# Altium schematic sheet PWR_Supply.SchDoc: Phaser
size 420 x 297 mm; EDA_Number: ARTIQ; Projet: ARTIQ/SINARA; Author: G.Kasprowicz; CompanyName: WUT ISE; DrawnBy: G.Kasprowicz; Organization: WUT ISE; Address1: PW ISE; Address2: Nowowiejska 15/19 00-665 Warsaw; Address3: gkasprow@gmail.com; DocumentNumber: 16; Revision: 2; SheetNumber: 16; SheetTotal: 18; ModifiedBy: -; CheckedDate: -; Title2: AFE PWR, testpoints, LEDs; DivGrp: WUT ISE; Designer: G.Kasprowicz; ModifiedDate: -; ProjectName: Sensor Box
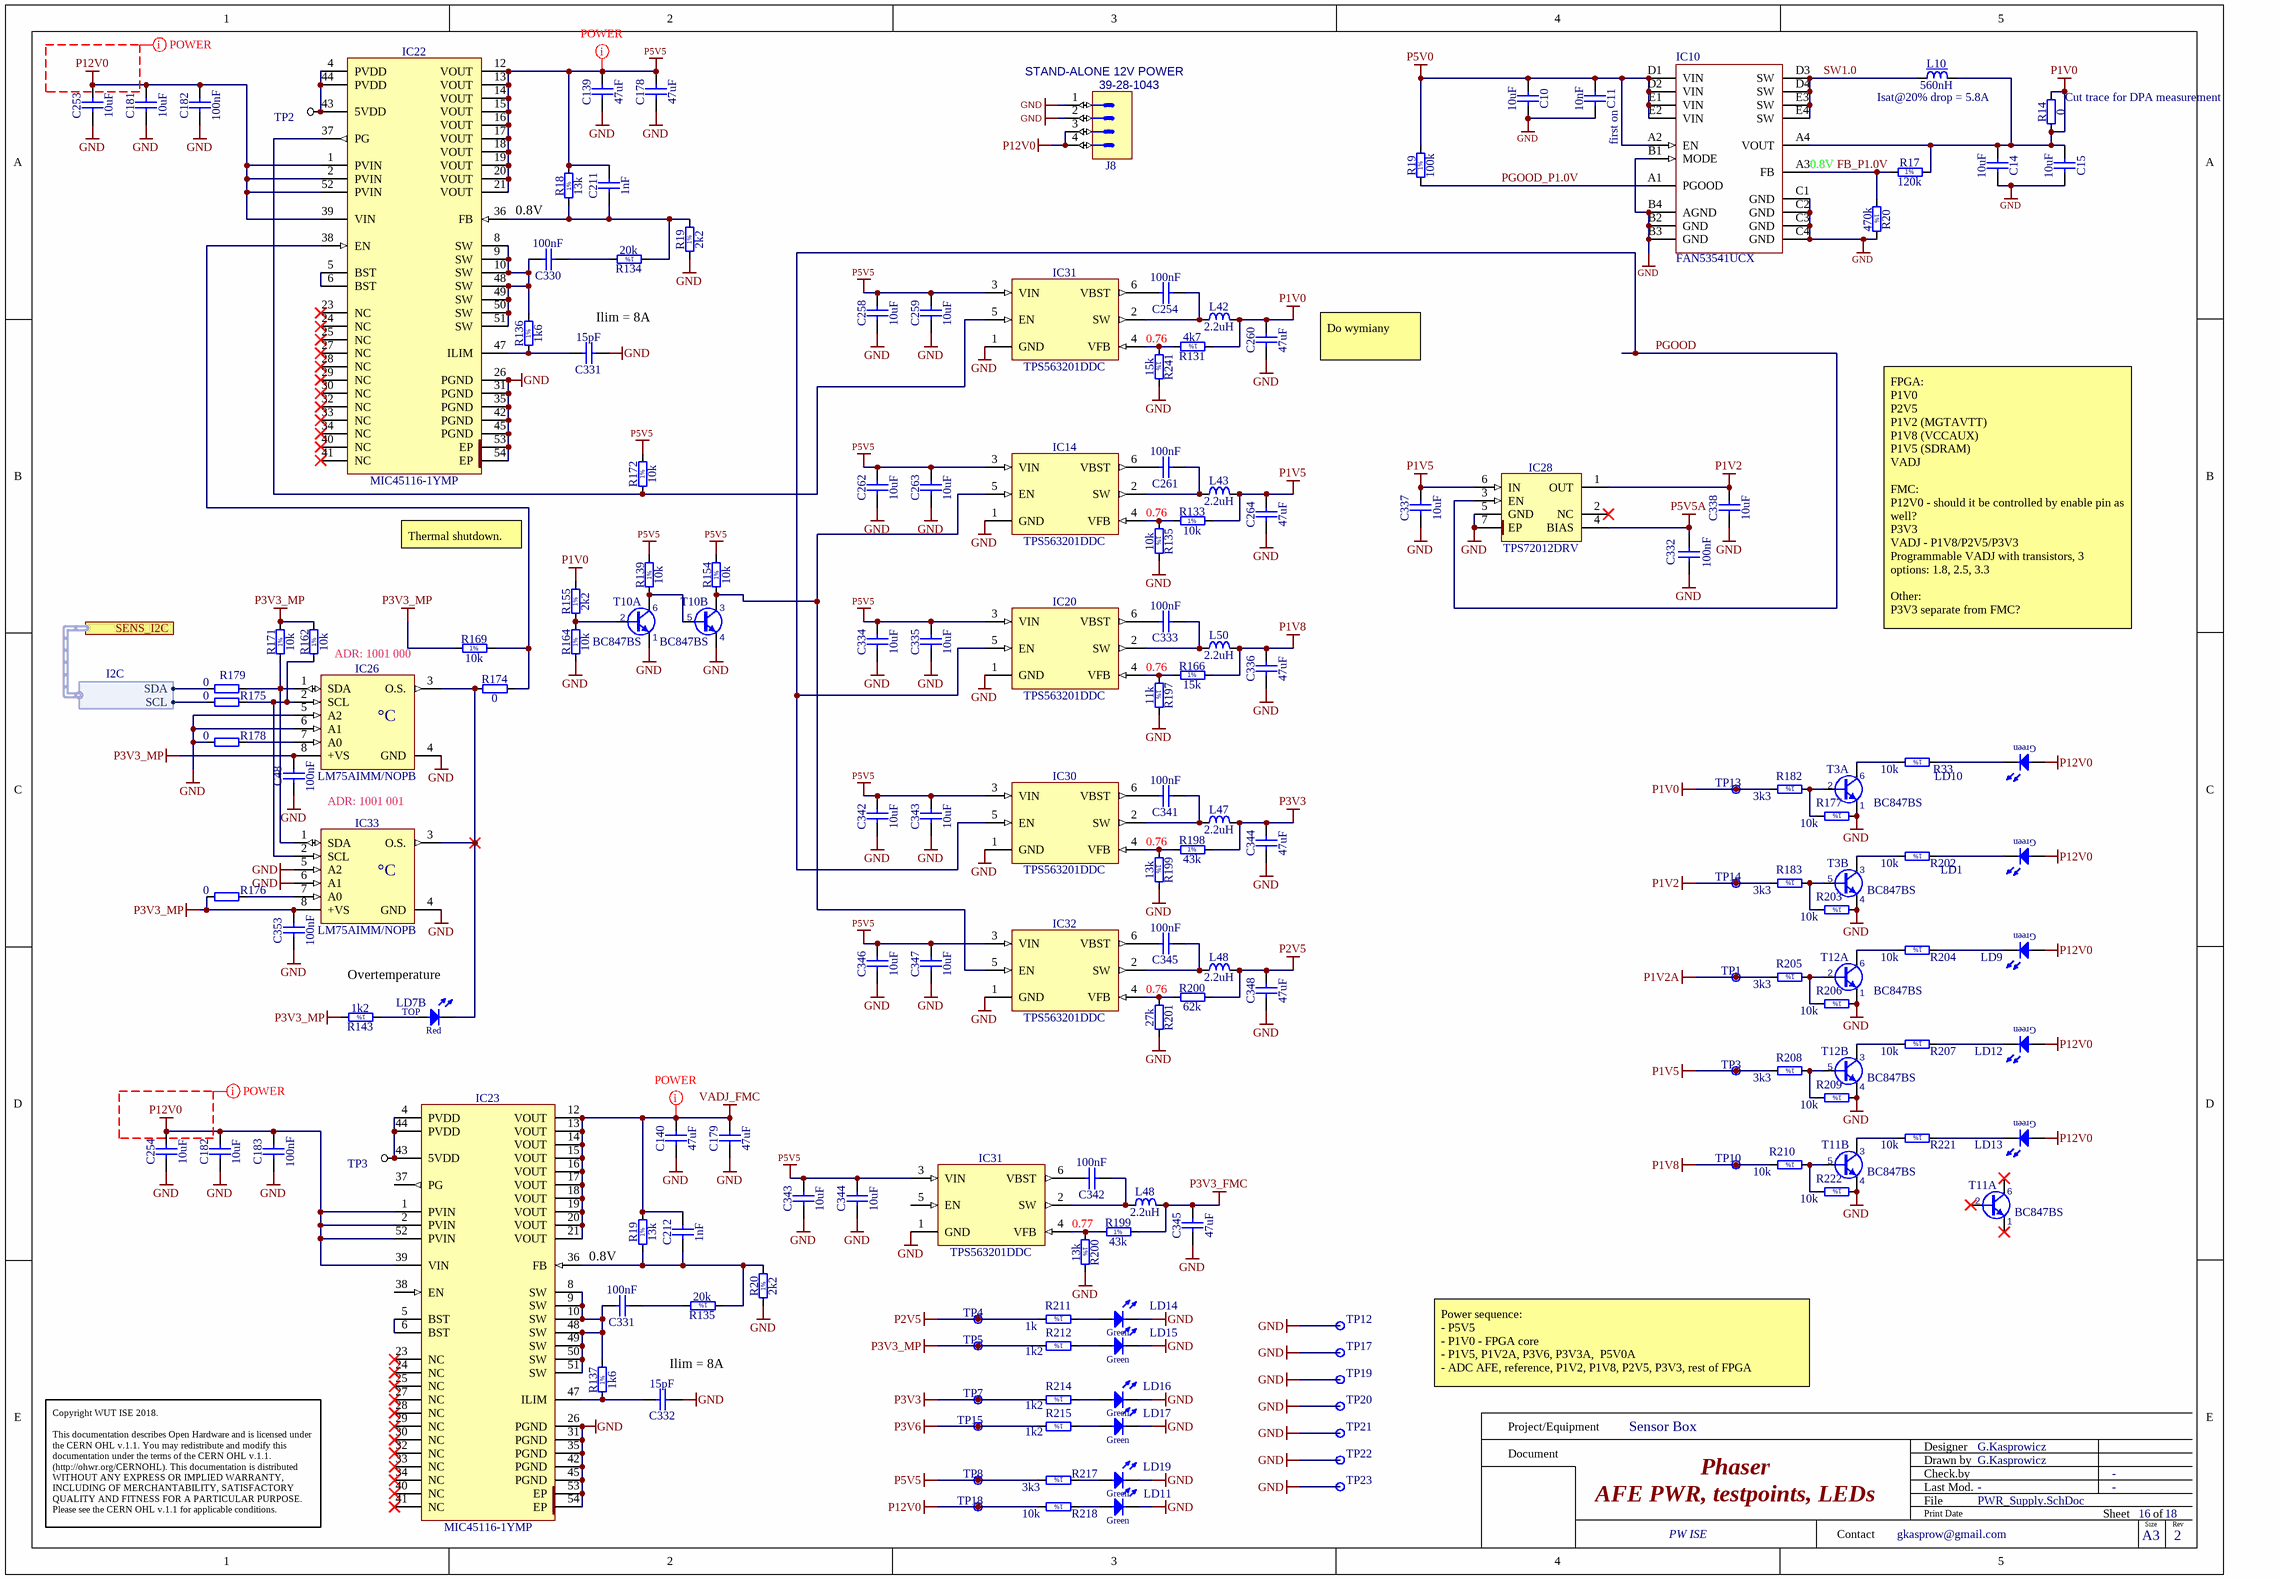
[diagram p0: PWR_Supply.SchDoc]

## Parts
(Parts that share a designator on the sheet are numbered #1, #2 ... from top to bottom, then left to right.)
C10  10uF  [CAPC1608X80N]
C11  10nF  [CAPC1005X55N]
C14  10uF  [CAPC1608X80N]
C15  10uF  [CAPC1608X80N]
C48  100nF  [CAPC1005X55N]
C139  47uF  [CAPC3225X270N]
C140  47uF  [CAPC3225X270N]
C178  47uF  [CAPC3225X270N]
C179  47uF  [CAPC3225X270N]
C181  10uF  [CAPC2012X135N]
C182#1  100nF  [CAPC1005X55N]
C182#2  10uF  [CAPC2012X135N]
C183  100nF  [CAPC1005X55N]
C211  1nF  [CAPC1608X87N]
C212  1nF  [CAPC1608X87N]
C253  10uF  [CAPC2012X135N]
C254#1  100nF  [CAPC1005X55N]
C254#2  10uF  [CAPC2012X135N]
C258  10uF  [CAPC2012X135N]
C259  10uF  [CAPC2012X135N]
C260  47uF  [CAPC3225X270N]
C261  100nF  [CAPC1005X55N]
C262  10uF  [CAPC2012X135N]
C263  10uF  [CAPC2012X135N]
C264  47uF  [CAPC3225X270N]
C330  100nF  [CAPC1005X55N]
C331#1  15pF  [CAPC1005X55N]
C331#2  100nF  [CAPC1005X55N]
C332#1  100nF  [CAPC1005X55N]
C332#2  15pF  [CAPC1005X55N]
C333  100nF  [CAPC1005X55N]
C334  10uF  [CAPC2012X135N]
C335  10uF  [CAPC2012X135N]
C336  47uF  [CAPC3225X270N]
C337  10uF  [CAPC2012X135N]
C338  10uF  [CAPC2012X135N]
C341  100nF  [CAPC1005X55N]
C342#1  10uF  [CAPC2012X135N]
C342#2  100nF  [CAPC1005X55N]
C343#1  10uF  [CAPC2012X135N]
C343#2  10uF  [CAPC2012X135N]
C344#1  47uF  [CAPC3225X270N]
C344#2  10uF  [CAPC2012X135N]
C345#1  100nF  [CAPC1005X55N]
C345#2  47uF  [CAPC3225X270N]
C346  10uF  [CAPC2012X135N]
C347  10uF  [CAPC2012X135N]
C348  47uF  [CAPC3225X270N]
C353  100nF  [CAPC1005X55N]
IC10  FAN53541UCX  [BGA20C40P4X5_156X196X62]
IC14  TPS563201DDC  [SOT95P280X110-6N]
IC20  TPS563201DDC  [SOT95P280X110-6N]
IC22  MIC45116-1YMP  [MICROCHIP_H3QFN88-52LD-PL-3]
IC23  MIC45116-1YMP  [MICROCHIP_H3QFN88-52LD-PL-3]
IC26  LM75AIMM/NOPB  [SOP65P490X109-8N]
IC28  TPS72012DRV  [SON65P200X200X80-7N-R110X170]
IC30  TPS563201DDC  [SOT95P280X110-6N]
IC31#1  TPS563201DDC  [SOT95P280X110-6N]
IC31#2  TPS563201DDC  [SOT95P280X110-6N]
IC32  TPS563201DDC  [SOT95P280X110-6N]
IC33  LM75AIMM/NOPB  [SOP65P490X109-8N]
J8  Manufacturer Part Number: 39-28-1043  [MOLEX_39-28-1043]  (hidden comment: Mini-Fit Jr.™)
L10  560nH  [IND_COILCRAFT_XAL5020]
L42  2.2uH  [IND_BOURNS_SRP5015TA]
L43  2.2uH  [IND_BOURNS_SRP5015TA]
L47  2.2uH  [IND_BOURNS_SRP5015TA]
L48#1  2.2uH  [IND_BOURNS_SRP5015TA]
L48#2  2.2uH  [IND_BOURNS_SRP5015TA]
L50  2.2uH  [IND_BOURNS_SRP5015TA]
LD1  Green  [LED_KINGBRIGHT_KPH-1608CGCKr]  (value not drawn)
LD7  Red/Green  [LED_DIALIGHT_571-0112F]  (value not drawn)  (part B of 2)
LD9  Green  [LED_KINGBRIGHT_KPH-1608CGCKr]  (value not drawn)
LD10  Green  [LED_KINGBRIGHT_KPH-1608CGCKr]  (value not drawn)
LD11  Green  [LED_KINGBRIGHT_KPH-1608CGCKr]  (value not drawn)
LD12  Green  [LED_KINGBRIGHT_KPH-1608CGCKr]  (value not drawn)
LD13  Green  [LED_KINGBRIGHT_KPH-1608CGCKr]  (value not drawn)
LD14  Green  [LED_KINGBRIGHT_KPH-1608CGCKr]  (value not drawn)
LD15  Green  [LED_KINGBRIGHT_KPH-1608CGCKr]  (value not drawn)
LD16  Green  [LED_KINGBRIGHT_KPH-1608CGCKr]  (value not drawn)
LD17  Green  [LED_KINGBRIGHT_KPH-1608CGCKr]  (value not drawn)
LD19  Green  [LED_KINGBRIGHT_KPH-1608CGCKr]  (value not drawn)
R14  0  [RESC1608X55N]
R17  120k  [RESC1005X40N]
R18  13k  [RESC1005X40N]
R19#1  100k  [RESC1005X40N]
R19#2  2k2  [RESC1608X55N]
R19#3  13k  [RESC1005X40N]
R20#1  470k  [RESC1005X40N]
R20#2  2k2  [RESC1608X55N]
R33  10k  [RESC1005X40N]
R131  4k7  [RESC1005X40N]
R133  10k  [RESC1005X40N]
R134  20k  [RESC1005X40N]
R135#1  10k  [RESC1005X40N]
R135#2  20k  [RESC1005X40N]
R136  1k6  [RESC1005X40N]
R137  1k6  [RESC1005X40N]
R139  10k  [RESC1005X40N]
R143  1k2  [RESC1608X55N]
R154  10k  [RESC1005X40N]
R155  2k2  [RESC1608X55N]
R162  10k  [RESC1005X40N]
R164  10k  [RESC1005X40N]
R166  15k  [RESC1005X40N]
R169  10k  [RESC1005X40N]
R171  10k  [RESC1005X40N]
R172  10k  [RESC1005X40N]
R174  0  [RESC1005X40N]
R175  0  [RESC1005X40N]
R176  0  [RESC1005X40N]
R177  10k  [RESC1005X40N]
R178  0  [RESC1005X40N]
R179  0  [RESC1005X40N]
R182  3k3  [RESC1608X55N]
R183  3k3  [RESC1608X55N]
R197  11k  [RESC1005X40N]
R198  43k  [RESC1005X40N]
R199#1  13k  [RESC1005X40N]
R199#2  43k  [RESC1005X40N]
R200#1  62k  [RESC1005X40N]
R200#2  13k  [RESC1005X40N]
R201  27k  [RESC1005X40N]
R202  10k  [RESC1005X40N]
R203  10k  [RESC1005X40N]
R204  10k  [RESC1005X40N]
R205  3k3  [RESC1608X55N]
R206  10k  [RESC1005X40N]
R207  10k  [RESC1005X40N]
R208  3k3  [RESC1608X55N]
R209  10k  [RESC1005X40N]
R210  10k  [RESC1005X40N]
R211  1k  [RESC1608X55N]
R212  1k2  [RESC1608X55N]
R214  1k2  [RESC1608X55N]
R215  1k2  [RESC1608X55N]
R217  3k3  [RESC1608X55N]
R218  10k  [RESC1005X40N]
R221  10k  [RESC1005X40N]
R222  10k  [RESC1005X40N]
R241  15k  [RESC1005X40N]
T3  BC847BS  [SOT65P210X110-6N]  (parts A,B of 2)
T10  BC847BS  [SOT65P210X110-6N]  (parts A,B of 2)
T11  BC847BS  [SOT65P210X110-6N]  (parts A,B of 2)
T12  BC847BS  [SOT65P210X110-6N]  (parts A,B of 2)
TP1  Test Point  [TPS127]  (value not drawn)
TP2  TP  [TP]  (value not drawn)
TP3#1  Test Point  [TPS127]  (value not drawn)
TP3#2  TP  [TP]  (value not drawn)
TP4  Test Point  [TPS127]  (value not drawn)
TP5  Test Point  [TPS127]  (value not drawn)
TP7  Test Point  [TPS127]  (value not drawn)
TP8  Test Point  [TPS127]  (value not drawn)
TP10  Test Point  [TPS127]  (value not drawn)
TP12  Test Point  [TPS127]  (value not drawn)
TP13  Test Point  [TPS127]  (value not drawn)
TP14  Test Point  [TPS127]  (value not drawn)
TP15  Test Point  [TPS127]  (value not drawn)
TP17  Test Point  [TPS127]  (value not drawn)
TP18  Test Point  [TPS127]  (value not drawn)
TP19  Test Point  [TPS127]  (value not drawn)
TP20  Test Point  [TPS127]  (value not drawn)
TP21  Test Point  [TPS127]  (value not drawn)
TP22  Test Point  [TPS127]  (value not drawn)
TP23  Test Point  [TPS127]  (value not drawn)

## Ports
SENS_I2C (harness I2C)

## Harnesses
I2C: SDA, SCL

## Nets
GND: C10.2 C11.2 C14.2 C15.2 C48.1 C139.1 C140.1 C178.1 C179.1 C181.1 C182#1.1 C182#2.1 C183.1 C253.1 C254#2.1 C258.1 C259.1 C260.1 C262.1 C263.1 C264.1 C331#1.1 C332#1.1 C332#2.1 C334.1 C335.1 C336.1 C337.1 C338.1 C342#1.1 C343#1.1 C343#2.1 C344#1.1 C344#2.1 C345#2.1 C346.1 C347.1 C348.1 C353.1 IC10.B1(MODE) IC10.B2(GND) IC10.B3(GND) IC10.B4(AGND) IC10.C1(GND) IC10.C2(GND) IC10.C3(GND) IC10.C4(GND) IC14.1(GND) IC20.1(GND) IC22.26(PGND) IC22.31(PGND) IC22.35(PGND) IC22.42(PGND) IC22.45(PGND) IC22.53(EP) IC22.54(EP) IC23.26(PGND) IC23.31(PGND) IC23.35(PGND) IC23.42(PGND) IC23.45(PGND) IC23.53(EP) IC23.54(EP) IC26.4(GND) IC26.5(A2) IC26.6(A1) IC28.5(GND) IC28.7(EP) IC30.1(GND) IC31#1.1(GND) IC31#2.1(GND) IC32.1(GND) IC33.4(GND) IC33.5(A2) IC33.6(A1) J8.1 J8.2 LD11.1(C) LD14.1(C) LD15.1(C) LD16.1(C) LD17.1(C) LD19.1(C) R19#2.1 R20#1.2 R20#2.1 R135#1.2 R164.1 R177.1 R178.1 R197.2 R199#1.2 R200#2.2 R201.2 R203.1 R206.1 R209.1 R222.1 R241.2 T3.1(E) T3.4(E) T10.1(E) T10.4(E) T11.4(E) T12.1(E) T12.4(E) TP12.1 TP17.1 TP19.1 TP20.1 TP21.1 TP22.1 TP23.1
P1V0: C14.1 C15.1 C260.2 IC10.A4(VOUT) L10.2 L42.2 R14.1 R14.2 R17.2 R131.1 R155.2 R182.2 TP13.1
P1V2: C338.2 IC28.1(OUT) R183.2 TP14.1
P1V2A: R205.2 TP1.1
P1V5: C264.2 C337.2 IC28.6(IN) L43.2 R133.2 R208.2 TP3#1.1
P1V8: C336.2 L50.2 R166.2 R210.2 TP10.1
P2V5: C348.2 L48#1.2 R200#1.2 R211.2 TP4.1
P3V3: C344#1.2 L47.2 R198.2 R214.2 TP7.1
P3V3_FMC: C345#2.2 L48#2.2 R199#2.2
P3V3_MP: C48.2 C353.2 IC26.8(+VS) IC33.8(+VS) R143.2 R162.2 R169.1 R171.2 R176.1 R212.2 TP5.1
P3V6: R215.2 TP15.1
P5V0: C10.1 C11.1 IC10.A2(EN) IC10.D1(VIN) IC10.D2(VIN) IC10.E1(VIN) IC10.E2(VIN) R19#1.2
P5V5: C139.2 C178.2 C211.2 C258.2 C259.2 C262.2 C263.2 C334.2 C335.2 C342#1.2 C343#1.2 C343#2.2 C344#2.2 C346.2 C347.2 IC14.3(VIN) IC20.3(VIN) IC22.12(VOUT) IC22.13(VOUT) IC22.14(VOUT) IC22.15(VOUT) IC22.16(VOUT) IC22.17(VOUT) IC22.18(VOUT) IC22.19(VOUT) IC22.20(VOUT) IC22.21(VOUT) IC30.3(VIN) IC31#1.3(VIN) IC31#2.3(VIN) IC32.3(VIN) R18.2 R139.2 R154.2 R172.2 R217.2 TP8.1
P5V5A: C332#1.2 IC28.4(BIAS)
P12V0: C181.2 C182#1.2 C182#2.2 C183.2 C253.2 C254#2.2 IC22.1(PVIN) IC22.2(PVIN) IC22.39(VIN) IC22.52(PVIN) IC23.1(PVIN) IC23.2(PVIN) IC23.39(VIN) IC23.52(PVIN) J8.3 J8.4 LD1.2(A) LD9.2(A) LD10.2(A) LD12.2(A) LD13.2(A) R218.2 TP18.1
VADJ_FMC: C140.2 C179.2 C212.2 IC23.12(VOUT) IC23.13(VOUT) IC23.14(VOUT) IC23.15(VOUT) IC23.16(VOUT) IC23.17(VOUT) IC23.18(VOUT) IC23.19(VOUT) IC23.20(VOUT) IC23.21(VOUT) R19#3.2
FB_P1.0V: IC10.A3(FB) R17.1 R20#1.1
PGOOD: IC20.5(EN) IC28.3(EN) IC30.5(EN)
PGOOD_P1.0V: IC10.A1(PGOOD) R19#1.1
SW1.0: IC10.D3(SW) IC10.D4(SW) IC10.E3(SW) IC10.E4(SW) L10.1
NetC211_1: C211.1 IC22.36(FB) R18.1 R19#2.2 R134.1
NetC212_1: C212.1 IC23.36(FB) R19#3.1 R20#2.2 R135#2.1
NetC254#1_1: C254#1.1 IC31#1.2(SW) L42.1
NetC254#1_2: C254#1.2 IC31#1.6(VBST)
NetC261_1: C261.1 IC14.2(SW) L43.1
NetC261_2: C261.2 IC14.6(VBST)
NetC330_1: C330.1 R134.2
NetC330_2: C330.2 IC22.8(SW) IC22.9(SW) IC22.10(SW) IC22.48(SW) IC22.49(SW) IC22.50(SW) IC22.51(SW) R136.2
NetC331#1_2: C331#1.2 IC22.47(ILIM) R136.1
NetC331#2_1: C331#2.1 R135#2.2
NetC331#2_2: C331#2.2 IC23.8(SW) IC23.9(SW) IC23.10(SW) IC23.48(SW) IC23.49(SW) IC23.50(SW) IC23.51(SW) R137.2
NetC332#2_2: C332#2.2 IC23.47(ILIM) R137.1
NetC333_1: C333.1 IC20.2(SW) L50.1
NetC333_2: C333.2 IC20.6(VBST)
NetC341_1: C341.1 IC30.2(SW) L47.1
NetC341_2: C341.2 IC30.6(VBST)
NetC342#2_1: C342#2.1 IC31#2.2(SW) L48#2.1
NetC342#2_2: C342#2.2 IC31#2.6(VBST)
NetC345#1_1: C345#1.1 IC32.2(SW) L48#1.1
NetC345#1_2: C345#1.2 IC32.6(VBST)
NetIC14_4: IC14.4(VFB) R133.1 R135#1.1
NetIC14_5: IC14.5(EN) IC32.5(EN) R154.1 T10.3(C)
NetIC20_4: IC20.4(VFB) R166.1 R197.1
NetIC22_4: IC22.4(PVDD) IC22.43(5VDD) IC22.44(PVDD) TP2.1
NetIC22_5: IC22.5(BST) IC22.6(BST)
NetIC22_37: IC22.37(PG) IC31#1.5(EN) R172.1
NetIC22_38: IC22.38(EN) R169.2 R174.2
NetIC23_4: IC23.4(PVDD) IC23.43(5VDD) IC23.44(PVDD) TP3#2.1
NetIC23_5: IC23.5(BST) IC23.6(BST)
NetIC26_1: IC26.1(SDA) IC33.1(SDA) R171.1 R179.2
NetIC26_2: IC26.2(SCL) IC33.2(SCL) R162.1 R175.2
NetIC26_3: IC26.3(O.S.) IC33.3(O.S.) LD7.3(C) R174.1
NetIC26_7: IC26.7(A0) R178.2
NetIC30_4: IC30.4(VFB) R198.1 R199#1.1
NetIC31#1_4: IC31#1.4(VFB) R131.2 R241.1
NetIC31#2_4: IC31#2.4(VFB) R199#2.1 R200#2.1
NetIC32_4: IC32.4(VFB) R200#1.1 R201.1
NetIC33_7: IC33.7(A0) R176.2
NetLD1_1: LD1.1(C) R202.1
NetLD7_4: LD7.4(A) R143.1
NetLD9_1: LD9.1(C) R204.1
NetLD10_1: LD10.1(C) R33.1
NetLD11_2: LD11.2(A) R218.1
NetLD12_1: LD12.1(C) R207.1
NetLD13_1: LD13.1(C) R221.1
NetLD14_2: LD14.2(A) R211.1
NetLD15_2: LD15.2(A) R212.1
NetLD16_2: LD16.2(A) R214.1
NetLD17_2: LD17.2(A) R215.1
NetLD19_2: LD19.2(A) R217.1
NetR33_2: R33.2 T3.6(C)
NetR139_1: R139.1 T10.5(B) T10.6(C)
NetR155_1: R155.1 R164.2 T10.2(B)
NetR175_1: R175.1 ; port SENS_I2C.SCL
NetR177_2: R177.2 R182.1 T3.2(B)
NetR179_1: R179.1 ; port SENS_I2C.SDA
NetR183_1: R183.1 R203.2 T3.5(B)
NetR202_2: R202.2 T3.3(C)
NetR204_2: R204.2 T12.6(C)
NetR205_1: R205.1 R206.2 T12.2(B)
NetR207_2: R207.2 T12.3(C)
NetR208_1: R208.1 R209.2 T12.5(B)
NetR210_1: R210.1 R222.2 T11.5(B)
NetR221_2: R221.2 T11.3(C)

Not connected (* = marked no-connect by the designer): IC22 23(NC)* 24(NC)* 25(NC)* 27(NC)* 28(NC)* 29(NC)* 30(NC)* 32(NC)* 33(NC)* 34(NC)* 40(NC)* 41(NC)*; IC23 23(NC)* 24(NC)* 25(NC)* 27(NC)* 28(NC)* 29(NC)* 30(NC)* 32(NC)* 33(NC)* 34(NC)* 37(PG) 38(EN) 40(NC)* 41(NC)*; IC28 2(NC)*; IC31#2 5(EN); T11 1(E)* 2(B)* 6(C)*

## Layout directives
net class POWER: P5V5, P12V0, VADJ_FMC

## Notes on the sheet
- (near J8) STAND-ALONE 12V POWER
- (near L10) Isat@20% drop = 5.8A
- (near R14) Cut trace for DPA measurement
- (near C11) first on
- (near IC10) 0.8V
- 0.8V
- (near C331#1) Ilim = 8A
- 0.76
- Do wymiany
- Thermal shutdown.
- ADR: 1001 000
- FPGA:
  P1V0
  P2V5
  P1V2 (MGTAVTT)
  P1V8 (VCCAUX)
  P1V5 (SDRAM)
  VADJ
  FMC:
  P12V0 - should it be controlled by enable pin as well?
  P3V3
  VADJ - P1V8/P2V5/P3V3
  Programmable VADJ with transistors, 3 options: 1.8, 2.5, 3.3
  Other:
  P3V3 separate from FMC?
- ADR: 1001 001
- Overtemperature
- 0.77
- (near C332#2) Ilim = 8A
- Power sequence:
  - P5V5
  - P1V0 - FPGA core
  - P1V5, P1V2A, P3V6, P3V3A,  P5V0A
  - ADC AFE, reference, P1V2, P1V8, P2V5, P3V3, rest of FPGA
- Project/Equipment
- Document
- Designer
- Drawn by
- Check.by
- Copyright WUT ISE 2018.
  This documentation describes Open Hardware and is licensed under the CERN OHL v.1.1. You may redistribute and modify this documentation under the terms of the CERN OHL v.1.1. (http://ohwr.org/CERNOHL). This documentation is distributed WITHOUT ANY EXPRESS OR IMPLIED WARRANTY, INCLUDING OF MERCHANTABILITY, SATISFACTORY QUALITY AND FITNESS FOR A PARTICULAR PURPOSE. Please see the CERN OHL v.1.1 for applicable conditions.
- Contact
- File
- Last Mod.
- Print Date
- Sheet
- Size
- A3
- of
- Rev
- (in symbol LED_DIALIGHT_571-0112F, part B) TOP; Red
- (in symbol LM75AIMM/NOPB) °C
- (in symbol R0402_1K6_1%_0.0625W_100PPM) 1%
- (in symbol R0402_4K7_1%_0.0625W_100PPM) 1%
- (in symbol R0402_10K_1%_0.0625W_100PPM) 1%
- (in symbol R0402_11K_1%_0.0625W_100PPM) 1%
- (in symbol R0402_13K_1%_0.0625W_100PPM) 1%
- (in symbol R0402_15K_1%_0.0625W_100PPM) 1%
- (in symbol R0402_20K_1%_0.0625W_100PPM) 1%
- (in symbol R0402_43K_1%_0.0625W_100PPM) 1%
- (in symbol R0402_100K_1%_0.0625W_100PPM) 1%
- (in symbol R0402_120K_1%_0.0625W_100PPM) 1%
- (in symbol R0402_470K_1%_0.0625W_100PPM) 1%
- (in symbol R0603_1K2_1%_0.1W_100PPM) 1%
- (in symbol R0603_1K_1%_0.1W_100PPM) 1%
- (in symbol R0603_2k2_1%_0.1W_100PPM) 1%
- (in symbol R0603_3k3_1%_0.1W_100PPM) 1%

## Library data of the parts
C10 C14 C15 = CC0603_10UF_10V_10%_X5R: Non-polarised capacitor; Part Description: SMD Multilayer Chip Ceramic Capacitor; Manufacturer: GENERIC; Manufacturer1 Part Number: GRM188R61A106KE69D; Voltage: 10V; TC: X5R; Tolerance: ±10%; Part Number: CC0603_10UF_10V_10%_X5R; Component Kind: Standard; Component Type: Standard; Pin Count: 2; Value: 10uF; Status: None; Manufacturer Part Number: CC0603_10UF_10V_10%_X5R; Case: 0603; Mounted: Yes; Socket: No; SMD: Yes; Sense: No; Manufacturer1 Example: MURATA; Manufacturer1 ComponentHeight: 0.8mm; HelpURL: \\cern.ch\dfs\Applications\Altium\Datasheets\CC0603_MURATA_GRM188R61A106KE69D.pdf; Author: CERN DEM JLC; CreateDate: 31.01.2017; LatestRevisionDate: 31.01.2017
C11 = CC0402_10NF_16V_10%_X7R: Non-polarised capacitor; Part Description: SMD Multilayer Chip Ceramic Capacitor; Manufacturer: GENERIC; Manufacturer1 Part Number: 223878715636; Voltage: 16V; TC: X7R; Tolerance: ±10%; Part Number: CC0402_10NF_16V_10%_X7R; Component Kind: Standard; Component Type: Standard; Pin Count: 2; Value: 10nF; Status: Not Recommended; Manufacturer Part Number: CC0402_10NF_16V_10%_X7R; Case: 0402; Mounted: Yes; Socket: No; SMD: Yes; Sense: No; Manufacturer1 Example: PHYCOMP; Manufacturer1 ComponentHeight: 0.55mm; HelpURL: \\cern.ch\dfs\Applications\Altium\Datasheets\CC0402_X7R_PHYCOMP.pdf; Author: CERN DEM JLC; CreateDate: 03.12.2007; LatestRevisionDate: 03.12.2007
C48 C353 = CC0402_100NF_16V_10%_X5R: Non-polarised capacitor; Part Description: SMD Multilayer Chip Ceramic Capacitor; Manufacturer: GENERIC; Manufacturer1 Part Number: GRM155R61C104KA88D; Voltage: 16V; TC: X5R; Tolerance: ±10%; Part Number: CC0402_100NF_16V_10%_X5R; Component Kind: Standard; Component Type: Standard; Pin Count: 2; Value: 100nF; Status: None; Manufacturer Part Number: CC0402_100NF_16V_10%_X5R; Case: 0402; Mounted: Yes; Socket: No; SMD: Yes; Sense: No; Manufacturer1 Example: MURATA; Manufacturer1 ComponentHeight: 0.55mm; HelpURL: \\cern.ch\dfs\Applications\Altium\Datasheets\CC0402_X5R_MURATA_GRM.pdf; Author: CERN DEM JLC; CreateDate: 10.12.2013; LatestRevisionDate: 10.12.2013
C139 C140 C178 C179 C260 C264 C336 C344#1 C345#2 C348 = CC1210_47UF_10V_20%_X5R: Non-polarised capacitor; Part Description: SMD Multilayer Chip Ceramic Capacitor; Manufacturer: GENERIC; Manufacturer1 Part Number: LMK325BJ476MM-T; Voltage: 10V; TC: X5R; Tolerance: ±20%; Part Number: CC1210_47UF_10V_20%_X5R; Component Kind: Standard; Component Type: Standard; Pin Count: 2; Value: 47uF; Status: None; Manufacturer Part Number: CC1210_47UF_10V_20%_X5R; Case: 1210; Mounted: Yes; Socket: No; SMD: Yes; Sense: No; Manufacturer1 Example: TAIYO YUDEN; Manufacturer1 ComponentHeight: 2.7mm; HelpURL: \\cern.ch\dfs\Applications\Altium\Datasheets\CC1210_X5R_TAIYO-YUDEN_HIGH-VALUE.pdf; Author: CERN DEM JLC; CreateDate: 04.05.2011; LatestRevisionDate: 04.05.2011
C181 C182#2 C253 C254#2 C258 C259 C262 C263 C334 C335 C337 C338 C342#1 C343#1 C343#2 C344#2 C346 C347 = CC0805_10UF_16V_10%_X5R: Non-polarised capacitor; Part Description: SMD Multilayer Chip Ceramic Capacitor; Manufacturer: GENERIC; Manufacturer1 Part Number: C0805C106K4PAC; Voltage: 16V; TC: X5R; Tolerance: ±10%; Part Number: CC0805_10UF_16V_10%_X5R; Component Kind: Standard; Component Type: Standard; Pin Count: 2; Value: 10uF; Status: Preferred; Manufacturer Part Number: CC0805_10UF_16V_10%_X5R; Case: 0805; Mounted: Yes; Socket: No; SMD: Yes; Manufacturer1 Example: KEMET; Manufacturer1 ComponentHeight: 1.4mm; HelpURL: \\cern.ch\dfs\Applications\Altium\Datasheets\CC1206_X5R_KEMET.pdf; Author: CERN DEM JLC; CreateDate: 03.12.2007; LatestRevisionDate: 03.12.2007; Sense: No
C182#1 C183 C254#1 C261 C330 C331#2 C332#1 C333 C341 C342#2 C345#1 = CC0402_100NF_16V_10%_X5R: Non-polarised capacitor; Part Description: SMD Multilayer Chip Ceramic Capacitor; Manufacturer: GENERIC; Manufacturer1 Part Number: GRM155R61C104KA88D; Voltage: 16V; TC: X5R; Tolerance: ±10%; Table: Capacitors SMD; Part Number: CC0402_100NF_16V_10%_X5R; Component Kind: Standard; Component Type: Standard; Pin Count: 2; Value: 100nF; Status: None; Manufacturer Part Number: CC0402_100NF_16V_10%_X5R; Case: 0402; Mounted: Yes; Socket: No; SMD: Yes; Manufacturer1 Example: MURATA; Manufacturer1 ComponentHeight: 0.55mm; HelpURL: \\cern.ch\dfs\Applications\Altium\Datasheets\CC0402_X5R_MURATA_GRM.pdf; Author: CERN DEM JLC; CreateDate: 2013-12-10; LatestRevisionDate: 2013-12-10
C211 C212 = CC0603_1NF_100V_10%_X7R: Non-polarised capacitor; Part Description: SMD Multilayer Chip Ceramic Capacitor; Manufacturer: GENERIC; Manufacturer1 Part Number: C0603C102K1RACTU; Voltage: 100V; TC: X7R; Tolerance: ±10%; Part Number: CC0603_1NF_100V_10%_X7R; Component Kind: Standard; Component Type: Standard; Pin Count: 2; Value: 1nF; Status: Preferred; Manufacturer Part Number: CC0603_1NF_100V_10%_X7R; Case: 0603; Mounted: Yes; Socket: No; SMD: Yes; Sense: No; Manufacturer1 Example: KEMET; Manufacturer1 ComponentHeight: 0.87mm; HelpURL: \\cern.ch\dfs\Applications\Altium\Datasheets\CC0603_X7R_KEMET.pdf; Author: CERN DEM JLC; CreateDate: 12.12.2013; LatestRevisionDate: 12.12.2013
C331#1 C332#2 = CC0402_15PF_50V_5%_C0G: Non-polarised capacitor; Part Description: SMD Multilayer Chip Ceramic Capacitor; Manufacturer: GENERIC; Manufacturer1 Part Number: C0402C150J5GACTU; Voltage: 50V; TC: C0G/NP0; Tolerance: ±5%; Part Number: CC0402_15PF_50V_5%_C0G; Component Kind: Standard; Component Type: Standard; Pin Count: 2; Value: 15pF; Status: Preferred; Manufacturer Part Number: CC0402_15PF_50V_5%_C0G; Case: 0402; Mounted: Yes; Socket: No; SMD: Yes; Sense: No; Manufacturer1 Example: KEMET; Manufacturer1 ComponentHeight: 0.55mm; HelpURL: \\cern.ch\dfs\Applications\Altium\Datasheets\CC0805_C0G_KEMET_(Commercial Grade).pdf; Author: CERN DEM JLC; CreateDate: 03.12.2007; LatestRevisionDate: 22.04.2015
IC10 = FAN53541UCX: 2.4MHz, 5A TinyBuck Synchronous Buck Regulator; MYPN: UFAN53541UCX; VENDOR: Fairchild Semiconductor; MPN: FAN53541UCX
IC14 IC20 IC30 IC31#1 IC31#2 IC32 = TPS563201DDC: 4.5V to 17V Input, 3A Synchronous Step-Down Voltage Regulator; Manufacturer: TEXAS INSTRUMENTS; PressFit: No; Bonding: No; Part Number: TPS563201DDC; Component Kind: Standard; Component Type: Standard; Device: TPS563201DDC; PackageDescription: SOT, 0.95mm Pitch; 6 Pin, 1.60mm W X 2.90mm L X 1.10mm H Body, IPC Medium Density; Part Description: 4.5V to 17V Input, 3A Synchronous Step-Down Voltage Regulator; Manufacturer Part Number: TPS563201DDC; Pin Count: 6; Case: SOT23-6; Mounted: Yes; Socket: No; SMD: Yes; Sense: No; ComponentHeight: 1.1mm; HelpURL: \\cern.ch\dfs\Applications\Altium\Datasheets\TPS563201DDC.pdf; Author: CERN DEM MR; CreateDate: 23.08.2018; LatestRevisionDate: 23.08.2018
IC22 IC23 = MIC45116-1YMP: 0.8V to 85% PVIN (4.75-19V), 6A Synchronous Step-Down Regulator Module; Manufacturer: MICROCHIP TECHNOLOGY; PressFit: No; Bonding: No; Part Number: MIC45116-1YMP; Component Kind: Standard; Component Type: Standard; Device: MIC45116-1YMP; PackageDescription: MICROCHIP_H3QFN88-52LD-PL-3, 0.50mm Pitch, Square, 52 Pin, 8mm L X 8mm W X 3mm H Body; Part Description: 0.8V to 85% PVIN (4.75-19V), 6A Synchronous Step-Down Regulator Module; Manufacturer Part Number: MIC45116-1YMP; Pin Count: 53; Mounted: Yes; Socket: No; SMD: Yes; Sense: No; ComponentHeight: 3mm; HelpURL: \\cern.ch\dfs\Applications\Altium\Datasheets\MIC45116-1YMP.pdf; Author: CERN DEM JMW; CreateDate: 15.08.2016; LatestRevisionDate: 15.08.2016
IC26 IC33 = LM75AIMM/NOPB: Digital Temperature Sensor and Thermal Watchdog with Two-Wire Interface; Part Description: -25° to +100°C ±2°C Digital Temperature Sensor and Thermal Watchdog with Two-Wire Interface; Manufacturer: TEXAS INSTRUMENTS; PressFit: No; Bonding: No; Part Number: LM75AIMM/NOPB; Component Kind: Standard; Component Type: Standard; Device: LM75AIMM/NOPB; PackageDescription: SOP, 0.65mm pitch; 8 pin,3.00mm W X 3.00mm L X 1.09mm H bodyI, PC Medium Density; Manufacturer Part Number: LM75AIMM/NOPB; Pin Count: 8; Case: SSOP8; Mounted: Yes; Socket: No; SMD: Yes; Sense: No; ComponentHeight: 1.09mm; HelpURL: \\cern.ch\dfs\Applications\Altium\Datasheets\LM75AIMM-NOPB.pdf; Author: CERN DEM JLC; CreateDate: 15.10.2012; LatestRevisionDate: 15.10.2012
IC28 = TPS72012DRV: 350 mA, Ultra-Low VIN, RF Low-Dropout Linear Regulator With Bias Pin; Part Description: 1.2V, 350mA, Ultra-Low Vin, RF Low-Dropout Linear Regulator With Bias Pin; Manufacturer: TEXAS INSTRUMENTS; PressFit: No; Bonding: No; Part Number: TPS72012DRV; Component Kind: Standard; Component Type: Standard; Device: TPS72012DRV; PackageDescription: SON, 0.65mm, Pitch; 6 Pin,2.00mm W X 2.00mm L X 0.80mm H body (W/Thermal Tab 1.1mm X 1.7mm),  IPC Medium Density; Manufacturer Part Number: TPS72012DRV; Pin Count: 7; Case: SON6; Mounted: Yes; Socket: No; SMD: Yes; Sense: No; ComponentHeight: 0.8mm; HelpURL: \\cern.ch\dfs\Applications\Altium\Datasheets\TPS72012DRV.pdf; Author: CERN DEM JMW; CreateDate: 2019-12-02; LatestRevisionDate: 2019-12-02
J8 = MOLEX_39-28-1043: Connector 4 Male; Manufacturer: MOLEX; Part Description: 4.20mm (.165") Pitch Mini-Fit Jr.™ Header, Dual Row, Vertical, without Snap-in Plastic Peg PCB Lock, 4 Circuits; PressFit: No; Part Number: MOLEX_39-28-1043; Component Kind: Standard; Component Type: Standard; Pin Count: 4; Family: Mini-Fit Jr.™; Mounted: Yes; Socket: No; SMD: No; Sense: No; Status: None; ComponentHeight: 13.1mm; HelpURL: \\cern.ch\dfs\Applications\Altium\Datasheets\MOLEX_39-28-1043.pdf; Author: CERN DEM JLC; CreateDate: 12.03.2009; LatestRevisionDate: 06.03.2012
L10 = IND_560NH_20%_COILCRAFT_XAL5020: Inductor With Core; Part Description: SMD Shielded Power Inductor; Manufacturer Part Number: XAL5020-561MEB; Power: 9.9A; Resistance: 0.00954R; Tolerance: ±20%; Part Number: IND_560NH_20%_COILCRAFT_XAL5020; Component Kind: Standard; Component Type: Standard; Pin Count: 2; Value: 560nH; Status: None; Manufacturer: COILCRAFT; Mounted: Yes; Socket: No; SMD: Yes; Sense: No; ComponentHeight: 2mm; HelpURL: \\cern.ch\dfs\Applications\Altium\Datasheets\IND_COILCRAFT_XAL5020.pdf; Author: CERN DEM MR; CreateDate: 14.03.2016; LatestRevisionDate: 14.03.2016
L42 L43 L47 L48#1 L48#2 L50 = IND_2.2UH_20%_BOURNS_SRP5015TA: Inductor; Part Description: Shielded SMD Power Inductor; Manufacturer: BOURNS; Manufacturer Part Number: SRP5015TA-2R2M; Power: 4A; Resistance: 0.045R; Tolerance: ±20%; Part Number: IND_2.2UH_20%_BOURNS_SRP5015TA; Component Kind: Standard; Component Type: Standard; Pin Count: 2; Value: 2.2uH; Status: None; Mounted: Yes; Socket: No; SMD: Yes; Sense: No; ComponentHeight: 1.5mm; HelpURL: \\cern.ch\dfs\Applications\Altium\Datasheets\IND_BOURNS_SRP5015TA.pdf; Author: CERN DEM JMW; CreateDate: 24.06.2019; LatestRevisionDate: 24.06.2019
LD1 LD9-LD17 LD19 = LED_0603_Green: Green 0603; Part Number: LED_KINGBRIGHT_KPH-1608CGCK; Part Description: SMD Green LED, Case 1.6mmX0.8mm(0603), 0.65mm Thickness; Manufacturer: KINGBRIGHT; Manufacturer Part Number: KPH-1608CGCK; PressFit: No; Bonding: No; Component Kind: Standard; Component Type: Standard; Color: Green; Footprint: LED_KINGBRIGHT_KPH-1608CGCK; PackageDescription: SMT Green LED, Case 0603, Body L 1.6 x W 0.8mm H 0.65mm; Pin Count: 2; Mounted: Yes; Socket: No; SMD: Yes; Sense: No; ComponentHeight: 0.65mm; HelpURL: \\cern.ch\dfs\Applications\Altium\Datasheets\LED_KINGBRIGHT_KPH-1608CGCK.pdf; Author: CERN DEM JLC; CreateDate: 03.07.2017; LatestRevisionDate: 03.07.2017
LD7 = LED_DIALIGHT_571-0112F: 2x LED  Botom Green, Top Red; Part Description: Dual 2mm  LEDs, Red Top,Green Bot, CBI® Circuit Board Indicator (Without positioning pins); PressFit: No; Bonding: No; Part Number: LED_DIALIGHT_571-0112F; Component Kind: Standard; Component Type: Standard; Color: Red/Green; PackageDescription: 2x 2mm LED (Top: Red, Bot: Green) PCB Edge Mounting (Without positioning pins) DIALIGHT 571 Serie; Manufacturer: DIALIGHT; Manufacturer Part Number: 571-0112F; Pin Count: 4; Mounted: Yes; Socket: No; SMD: No; Sense: No; ComponentHeight: 8.6mm; HelpURL: \\cern.ch\dfs\Applications\Altium\Datasheets\LED_DIALIGHT_571-0112F.pdf; Author: CERN DEM JLC; CreateDate: 09.11.2009; LatestRevisionDate: 17.03.2010
R14 = R0603_0R_JUMPER: Resistor; Part Description: 1A (0.05R Max DC Resistance) Zero Ohm Jumper; Manufacturer: GENERIC; Manufacturer1 Part Number: NRC06Z0; PressFit: No; Part Number: R0603_0R_JUMPER; Component Kind: Standard; Component Type: Standard; Pin Count: 2; Value: 0; Status: Preferred; Manufacturer Part Number: R0603_0R_JUMPER; Case: 0603; Mounted: Yes; Sense: No; Socket: No; SMD: Yes; Manufacturer1 Example: NIC COMPONENT; Manufacturer1 ComponentHeight: 0.55mm; HelpURL: \\cern.ch\dfs\Applications\Altium\Datasheets\R0603_NIC_NRC.pdf; Author: CERN DEM JLC; CreateDate: 03.12.2007; LatestRevisionDate: 13.03.2008
R17 = R0402_120K_1%_0.0625W_100PPM: Resistor - 1%; Part Description: General Purpose Thick Film Chip Resistor; Manufacturer: GENERIC; Manufacturer1 Part Number: 232270671204L; TC: ±100ppm/°C; PressFit: No; Part Number: R0402_120K_1%_0.0625W_100PPM; Component Kind: Standard; Component Type: Standard; Pin Count: 2; Value: 120k; Status: Not Recommended; Power: 0.0625W; Tolerance: ±1%; Manufacturer Part Number: R0402_120K_1%_0.0625W_100PPM; Case: 0402; Mounted: Yes; Sense: No; Socket: No; SMD: Yes; Manufacturer1 Example: YAGEO PHYCOMP; Manufacturer1 ComponentHeight: 0.4mm; HelpURL: \\cern.ch\dfs\Applications\Altium\Datasheets\R0402_Phycomp_RC0402.pdf; Author: CERN DEM JLC; CreateDate: 03.12.2007; LatestRevisionDate: 17.10.2012
R18 R19#3 R199#1 R200#2 = R0402_13K_1%_0.0625W_100PPM: Resistor - 1%; Part Description: General Purpose Thick Film Chip Resistor; Manufacturer: GENERIC; Manufacturer1 Part Number: 232270671303L; TC: ±100ppm/°C; PressFit: No; Part Number: R0402_13K_1%_0.0625W_100PPM; Component Kind: Standard; Component Type: Standard; Pin Count: 2; Value: 13k; Status: Not Recommended; Power: 0.0625W; Tolerance: ±1%; Manufacturer Part Number: R0402_13K_1%_0.0625W_100PPM; Case: 0402; Mounted: Yes; Sense: No; Socket: No; SMD: Yes; Manufacturer1 Example: YAGEO PHYCOMP; Manufacturer1 ComponentHeight: 0.4mm; HelpURL: \\cern.ch\dfs\Applications\Altium\Datasheets\R0402_Phycomp_RC0402.pdf; Author: CERN DEM JLC; CreateDate: 03.12.2007; LatestRevisionDate: 17.10.2012
R19#1 = R0402_100K_1%_0.0625W_100PPM: Resistor - 1%; Part Description: General Purpose Thick Film Chip Resistor; Manufacturer: GENERIC; Manufacturer1 Part Number: 232270671004L; TC: ±100ppm/°C; PressFit: No; Part Number: R0402_100K_1%_0.0625W_100PPM; Component Kind: Standard; Component Type: Standard; Pin Count: 2; Value: 100k; Status: Not Recommended; Power: 0.0625W; Tolerance: ±1%; Manufacturer Part Number: R0402_100K_1%_0.0625W_100PPM; Case: 0402; Mounted: Yes; Sense: No; Socket: No; SMD: Yes; Manufacturer1 Example: YAGEO PHYCOMP; Manufacturer1 ComponentHeight: 0.4mm; HelpURL: \\cern.ch\dfs\Applications\Altium\Datasheets\R0402_Phycomp_RC0402.pdf; Author: CERN DEM JLC; CreateDate: 03.12.2007; LatestRevisionDate: 17.10.2012
R19#2 R20#2 R155 = R0603_2k2_1%_0.1W_100PPM: Resistor - 1%; Part Description: General Purpose Thick Film Chip Resistor; Manufacturer: GENERIC; Manufacturer1 Part Number: NRC06F2201TRF; Power: 0.1W; TC: ±100ppm/°C; PressFit: No; Part Number: R0603_2K2_1%_0.1W_100PPM; Component Kind: Standard; Component Type: Standard; Pin Count: 2; Value: 2k2; Status: Preferred; Tolerance: ±1%; Manufacturer Part Number: R0603_2K2_1%_0.1W_100PPM; Case: 0603; Mounted: Yes; Sense: No; Socket: No; SMD: Yes; Manufacturer1 Example: NIC COMPONENT; Manufacturer1 ComponentHeight: 0.55mm; HelpURL: \\cern.ch\dfs\Applications\Altium\Datasheets\R0603_NIC_NRC.pdf; Author: CERN DEM JLC; CreateDate: 03.12.2007; LatestRevisionDate: 13.03.2008
R20#1 = R0402_470K_1%_0.0625W_100PPM: Resistor - 1%; Part Description: General Purpose Thick Film Chip Resistor; Manufacturer: GENERIC; Manufacturer1 Part Number: 232270674704L; TC: ±100ppm/°C; PressFit: No; Part Number: R0402_470K_1%_0.0625W_100PPM; Component Kind: Standard; Component Type: Standard; Pin Count: 2; Value: 470k; Status: Not Recommended; Power: 0.0625W; Tolerance: ±1%; Manufacturer Part Number: R0402_470K_1%_0.0625W_100PPM; Case: 0402; Mounted: Yes; Sense: No; Socket: No; SMD: Yes; Manufacturer1 Example: YAGEO PHYCOMP; Manufacturer1 ComponentHeight: 0.4mm; HelpURL: \\cern.ch\dfs\Applications\Altium\Datasheets\R0402_Phycomp_RC0402.pdf; Author: CERN DEM JLC; CreateDate: 03.12.2007; LatestRevisionDate: 17.10.2012
R33 R177 R202-R204 R206 R207 R209 R210 R218 R221 R222 = R0402_10K_1%_0.0625W_100PPM: Resistor - 1%; Part Description: General Purpose Thick Film Chip Resistor; Manufacturer: GENERIC; Manufacturer1 Part Number: 232270671003L; TC: ±100ppm/°C; Part Number: R0402_10K_1%_0.0625W_100PPM; Component Kind: Standard; Component Type: Standard; Pin Count: 2; Value: 10k; Status: Not recommended; Power: 0.0625W; Tolerance: ±1%; Manufacturer Part Number: R0402_10K_1%_0.0625W_100PPM; Case: 0402; Mounted: Yes; Sense: No; Socket: No; SMD: Yes; Manufacturer1 Example: YAGEO PHYCOMP; Manufacturer1 ComponentHeight: 0.4mm; HelpURL: \\cern.ch\dfs\Applications\Altium\Datasheets\R0402_Phycomp_RC0402.pdf; Author: CERN DEM JLC; CreateDate: 03.12.2007; LatestRevisionDate: 17.10.2012
R131 = R0402_4K7_1%_0.0625W_100PPM: Resistor - 1%; Part Description: General Purpose Thick Film Chip Resistor; Manufacturer: GENERIC; Manufacturer1 Part Number: 232270674702L; TC: ±100ppm/°C; PressFit: No; Part Number: R0402_4K7_1%_0.0625W_100PPM; Component Kind: Standard; Component Type: Standard; Pin Count: 2; Value: 4k7; Status: Not Recommended; Power: 0.0625W; Tolerance: ±1%; Manufacturer Part Number: R0402_4K7_1%_0.0625W_100PPM; Case: 0402; Mounted: Yes; Sense: No; Socket: No; SMD: Yes; Manufacturer1 Example: YAGEO PHYCOMP; Manufacturer1 ComponentHeight: 0.4mm; HelpURL: \\cern.ch\dfs\Applications\Altium\Datasheets\R0402_Phycomp_RC0402.pdf; Author: CERN DEM JLC; CreateDate: 03.12.2007; LatestRevisionDate: 17.10.2012
R133 R135#1 R139 R154 R162 R164 R169 R171 R172 = R0402_10K_1%_0.0625W_100PPM: Resistor - 1%; Part Description: General Purpose Thick Film Chip Resistor; Manufacturer: GENERIC; Manufacturer1 Part Number: 232270671003L; TC: ±100ppm/°C; PressFit: No; Part Number: R0402_10K_1%_0.0625W_100PPM; Component Kind: Standard; Component Type: Standard; Pin Count: 2; Value: 10k; Status: Not Recommended; Power: 0.0625W; Tolerance: ±1%; Manufacturer Part Number: R0402_10K_1%_0.0625W_100PPM; Case: 0402; Mounted: Yes; Sense: No; Socket: No; SMD: Yes; Manufacturer1 Example: YAGEO PHYCOMP; Manufacturer1 ComponentHeight: 0.4mm; HelpURL: \\cern.ch\dfs\Applications\Altium\Datasheets\R0402_Phycomp_RC0402.pdf; Author: CERN DEM JLC; CreateDate: 03.12.2007; LatestRevisionDate: 17.10.2012
R134 R135#2 = R0402_20K_1%_0.0625W_100PPM: Resistor - 1%; Part Description: General Purpose Thick Film Chip Resistor; Manufacturer: GENERIC; Manufacturer1 Part Number: 232270672003L; TC: ±100ppm/°C; PressFit: No; Part Number: R0402_20K_1%_0.0625W_100PPM; Component Kind: Standard; Component Type: Standard; Pin Count: 2; Value: 20k; Status: Not Recommended; Power: 0.0625W; Tolerance: ±1%; Manufacturer Part Number: R0402_20K_1%_0.0625W_100PPM; Case: 0402; Mounted: Yes; Socket: No; SMD: Yes; Manufacturer1 Example: YAGEO PHYCOMP; Manufacturer1 ComponentHeight: 0.4mm; HelpURL: \\cern.ch\dfs\Applications\Altium\Datasheets\R0402_Phycomp_RC0402.pdf; Author: CERN DEM JLC; CreateDate: 03.12.2007; LatestRevisionDate: 17.10.2012; Sense: No
R136 R137 = R0402_1K6_1%_0.0625W_100PPM: Resistor - 1%; Part Description: General Purpose Thick Film Chip Resistor; Manufacturer: GENERIC; Manufacturer1 Part Number: 232270671602L; TC: ±100ppm/°C; PressFit: No; Part Number: R0402_1K6_1%_0.0625W_100PPM; Component Kind: Standard; Component Type: Standard; Pin Count: 2; Value: 1k6; Status: Not Recommended; Power: 0.0625W; Tolerance: ±1%; Manufacturer Part Number: R0402_1K6_1%_0.0625W_100PPM; Case: 0402; Mounted: Yes; Sense: No; Socket: No; SMD: Yes; Manufacturer1 Example: YAGEO PHYCOMP; Manufacturer1 ComponentHeight: 0.4mm; HelpURL: \\cern.ch\dfs\Applications\Altium\Datasheets\R0402_Phycomp_RC0402.pdf; Author: CERN DEM JLC; CreateDate: 03.12.2007; LatestRevisionDate: 17.10.2012
R143 R212 R214 R215 = R0603_1K2_1%_0.1W_100PPM: Resistor - 1%; Part Description: General Purpose Thick Film Chip Resistor; Manufacturer: GENERIC; Manufacturer1 Part Number: NRC06F1201TRF; Power: 0.1W; TC: ±100ppm/°C; Part Number: R0603_1K2_1%_0.1W_100PPM; Component Kind: Standard; Component Type: Standard; Pin Count: 2; Value: 1k2; Status: Preferred; Tolerance: ±1%; Manufacturer Part Number: R0603_1K2_1%_0.1W_100PPM; Case: 0603; Mounted: Yes; Sense: No; Socket: No; SMD: Yes; Manufacturer1 Example: NIC COMPONENT; Manufacturer1 ComponentHeight: 0.55mm; HelpURL: \\cern.ch\dfs\Applications\Altium\Datasheets\R0603_NIC_NRC.pdf; Author: CERN DEM JLC; CreateDate: 03.12.2007; LatestRevisionDate: 13.03.2008
R166 R241 = R0402_15K_1%_0.0625W_100PPM: Resistor - 1%; Part Description: General Purpose Thick Film Chip Resistor; Manufacturer: GENERIC; Manufacturer1 Part Number: CRCW040215K0FKED; TC: ±100ppm/°C; PressFit: No; Part Number: R0402_15K_1%_0.0625W_100PPM; Component Kind: Standard; Component Type: Standard; Pin Count: 2; Value: 15k; Status: None; Power: 0.0625W; Tolerance: ±1%; Manufacturer Part Number: R0402_15K_1%_0.0625W_100PPM; Case: 0402; Mounted: Yes; Sense: No; Socket: No; SMD: Yes; Manufacturer1 Example: VISHAY; Manufacturer1 ComponentHeight: 0.4mm; HelpURL: \\cern.ch\dfs\Applications\Altium\Datasheets\R0402_VISHAY_CRCW e3.pdf; Author: CERN DEM JMW; CreateDate: 06.07.2015; LatestRevisionDate: 06.07.2015
R174-R176 R178 R179 = R0402_0R_JUMPER: Resistor; Part Description: 1A (0.05R Max DC Resistance) Zero Ohm Jumper; Manufacturer: GENERIC; Manufacturer1 Part Number: 232270591001L; Part Number: R0402_0R_JUMPER; Component Kind: Standard; Component Type: Standard; Pin Count: 2; Value: 0; Status: Not recommended; Manufacturer Part Number: R0402_0R_JUMPER; Case: 0402; Mounted: Yes; Sense: No; Socket: No; SMD: Yes; Manufacturer1 Example: YAGEO PHYCOMP; Manufacturer1 ComponentHeight: 0.4mm; HelpURL: \\cern.ch\dfs\Applications\Altium\Datasheets\R0402_Phycomp_RC0402.pdf; Author: CERN DEM JLC; CreateDate: 03.12.2007; LatestRevisionDate: 17.10.2012
R182 R183 R205 R208 R217 = R0603_3k3_1%_0.1W_100PPM: Resistor - 1%; Part Description: General Purpose Thick Film Chip Resistor; Manufacturer: GENERIC; Manufacturer1 Part Number: NRC06F3301TRF; Power: 0.1W; TC: ±100ppm/°C; PressFit: No; Part Number: R0603_3K3_1%_0.1W_100PPM; Component Kind: Standard; Component Type: Standard; Pin Count: 2; Value: 3k3; Status: Preferred; Tolerance: ±1%; Manufacturer Part Number: R0603_3K3_1%_0.1W_100PPM; Case: 0603; Mounted: Yes; Sense: No; Socket: No; SMD: Yes; Manufacturer1 Example: NIC COMPONENT; Manufacturer1 ComponentHeight: 0.55mm; HelpURL: \\cern.ch\dfs\Applications\Altium\Datasheets\R0603_NIC_NRC.pdf; Author: CERN DEM JLC; CreateDate: 03.12.2007; LatestRevisionDate: 13.03.2008
R197 = R0402_11K_1%_0.0625W_100PPM: Resistor - 1%; Part Description: General Purpose Thick Film Chip Resistor; Manufacturer: GENERIC; Manufacturer1 Part Number: 232270671103L; TC: ±100ppm/°C; PressFit: No; Part Number: R0402_11K_1%_0.0625W_100PPM; Component Kind: Standard; Component Type: Standard; Pin Count: 2; Value: 11k; Status: Not Recommended; Power: 0.0625W; Tolerance: ±1%; Manufacturer Part Number: R0402_11K_1%_0.0625W_100PPM; Case: 0402; Mounted: Yes; Sense: No; Socket: No; SMD: Yes; Manufacturer1 Example: YAGEO PHYCOMP; Manufacturer1 ComponentHeight: 0.4mm; HelpURL: \\cern.ch\dfs\Applications\Altium\Datasheets\R0402_Phycomp_RC0402.pdf; Author: CERN DEM JLC; CreateDate: 03.12.2007; LatestRevisionDate: 17.10.2012
R198 R199#2 = R0402_43K_1%_0.0625W_100PPM: Resistor - 1%; Part Description: General Purpose Thick Film Chip Resistor; Manufacturer: GENERIC; Manufacturer1 Part Number: 232270674303L; TC: ±100ppm/°C; PressFit: No; Part Number: R0402_43K_1%_0.0625W_100PPM; Component Kind: Standard; Component Type: Standard; Pin Count: 2; Value: 43k; Status: Not Recommended; Power: 0.0625W; Tolerance: ±1%; Manufacturer Part Number: R0402_43K_1%_0.0625W_100PPM; Case: 0402; Mounted: Yes; Sense: No; Socket: No; SMD: Yes; Manufacturer1 Example: YAGEO PHYCOMP; Manufacturer1 ComponentHeight: 0.4mm; HelpURL: \\cern.ch\dfs\Applications\Altium\Datasheets\R0402_Phycomp_RC0402.pdf; Author: CERN DEM JLC; CreateDate: 03.12.2007; LatestRevisionDate: 17.10.2012
R200#1 = R0402_62K_1%_0.0625W_100PPM: Resistor - 1%; Part Description: General Purpose Thick Film Chip Resistor; Manufacturer: GENERIC; Manufacturer1 Part Number: 232270676203L; TC: ±100ppm/°C; PressFit: No; Part Number: R0402_62K_1%_0.0625W_100PPM; Component Kind: Standard; Component Type: Standard; Pin Count: 2; Value: 62k; Status: Not Recommended; Power: 0.0625W; Tolerance: ±1%; Manufacturer Part Number: R0402_62K_1%_0.0625W_100PPM; Case: 0402; Mounted: Yes; Sense: No; Socket: No; SMD: Yes; Manufacturer1 Example: YAGEO PHYCOMP; Manufacturer1 ComponentHeight: 0.4mm; HelpURL: \\cern.ch\dfs\Applications\Altium\Datasheets\R0402_Phycomp_RC0402.pdf; Author: CERN DEM JLC; CreateDate: 03.12.2007; LatestRevisionDate: 17.10.2012
R201 = R0402_27K_1%_0.0625W_100PPM: Resistor - 1%; Part Description: General Purpose Thick Film Chip Resistor; Manufacturer: GENERIC; Manufacturer1 Part Number: 232270672703L; TC: ±100ppm/°C; PressFit: No; Part Number: R0402_27K_1%_0.0625W_100PPM; Component Kind: Standard; Component Type: Standard; Pin Count: 2; Value: 27k; Status: Not Recommended; Power: 0.0625W; Tolerance: ±1%; Manufacturer Part Number: R0402_27K_1%_0.0625W_100PPM; Case: 0402; Mounted: Yes; Sense: No; Socket: No; SMD: Yes; Manufacturer1 Example: YAGEO PHYCOMP; Manufacturer1 ComponentHeight: 0.4mm; HelpURL: \\cern.ch\dfs\Applications\Altium\Datasheets\R0402_Phycomp_RC0402.pdf; Author: CERN DEM JLC; CreateDate: 03.12.2007; LatestRevisionDate: 17.10.2012
R211 = R0603_1K_1%_0.1W_100PPM: Resistor - 1%; Part Description: General Purpose Thick Film Chip Resistor; Manufacturer: GENERIC; Manufacturer1 Part Number: NRC06F1001TRF; Power: 0.1W; TC: ±100ppm/°C; PressFit: No; Part Number: R0603_1K_1%_0.1W_100PPM; Component Kind: Standard; Component Type: Standard; Pin Count: 2; Value: 1k; Status: Preferred; Tolerance: ±1%; Manufacturer Part Number: R0603_1K_1%_0.1W_100PPM; Case: 0603; Mounted: Yes; Sense: No; Socket: No; SMD: Yes; Manufacturer1 Example: NIC COMPONENT; Manufacturer1 ComponentHeight: 0.55mm; HelpURL: \\cern.ch\dfs\Applications\Altium\Datasheets\R0603_NIC_NRC.pdf; Author: CERN DEM JLC; CreateDate: 03.12.2007; LatestRevisionDate: 13.03.2008
T3 T10-T12 = BC847BS: 45V 100mA Dual NPN General-Purpose Transistor; Manufacturer: NXP SEMICONDUCTORS; PressFit: No; Bonding: No; Part Number: BC847BS; Component Kind: Standard; Component Type: Standard; Device: BC847BS; PackageDescription: SOT363, SC-88, SOT, 0.65mm Pitch, 6 pin, 1.25mm W X 2.00mm L X 1.10mm H, IPC Medium Density; Part Description: 45V 100mA Dual NPN General-Purpose Transistor; Manufacturer Part Number: BC847BS; Pin Count: 6; Case: SOT363; Mounted: Yes; Socket: No; SMD: Yes; Sense: No; ComponentHeight: 1.1mm; HelpURL: \\cern.ch\dfs\Applications\Altium\Datasheets\BC847BS.pdf; Author: CERN DEM JMW; CreateDate: 10.07.2015; LatestRevisionDate: 10.07.2015
TP1 TP3#1 TP4 TP5 TP7 TP8 TP10 TP12-TP15 TP17-TP23 = SMD_PAD_1.27X1.27MM: Part Description: 1.27mm x 1.27mm PCB Copper Area (SMD Test Point); Mounted: No; Part Number: SMD_PAD_1.27X1.27MM; Component Kind: Standard (No BOM); Component Type: Standard (No BOM); Pin Count: 1; Family: Test Point; Socket: No; SMD: Yes; Sense: No; Status: None; ComponentHeight: 0mm; HelpURL: Undefined; Author: CERN DEM JLC; CreateDate: 12.01.2008; LatestRevisionDate: 12.01.2008; PackageDescription: 1.27mm x 1.27mm PCB Copper Area (SMD Test Point)
TP2 TP3#2 = TP: Testpoint